# Altium schematic sheet Solution_2.SchDoc
size A4
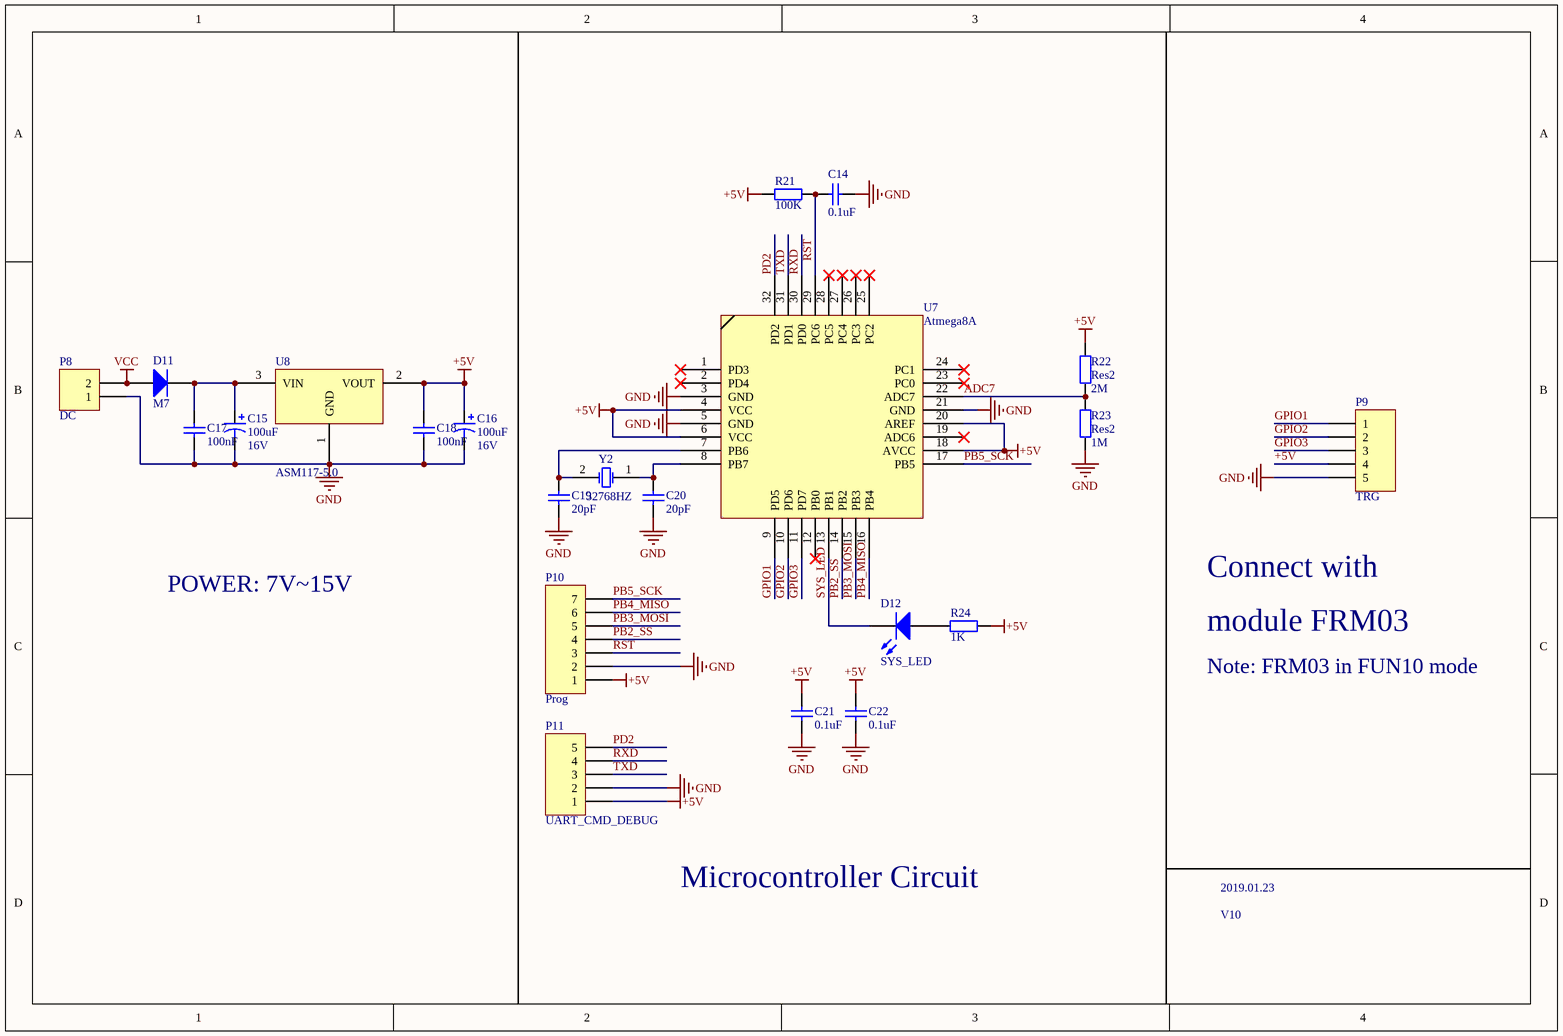
[diagram p0: Solution_2.SchDoc]

## Parts
C14  0.1uF  [RAD-0.3]
C15  100uF  value 16V  [C0805]
C16  100uF  value 16V  [C0805]
C17  100nF  [RAD-0.3]
C18  100nF  [RAD-0.3]
C19  20pF  [RAD-0.3]
C20  20pF  [RAD-0.3]
C21  0.1uF  [RAD-0.3]
C22  0.1uF  [RAD-0.3]
D11  M7  [SMC]
D12  SYS_LED  [LED-0]
P8  DC  [HDR1X2]
P9  TRG  [HDR1X5]
P10  Prog  [HDR1X7]
P11  UART_CMD_DEBUG  [HDR1X5]
R21  100K  [AXIAL-0.4]
R22  Res2  value 2M  [AXIAL-0.4]
R23  Res2  value 1M  [AXIAL-0.4]
R24  1K  [AXIAL-0.4]
U7  Atmega8A
U8  ASM117-5.0
Y2  32768HZ  [R38]

## Nets
+5V: C16.1 C18.2 C21.2 C22.2 P9.4 P10.1 P11.1 R21.1 R22.2 R24.2 U7.4(VCC) U7.6(VCC) U7.18(AVCC) U7.20(AREF) U8.2(VOUT)
GND: C14.1 C15.2 C16.2 C17.1 C18.1 C19.1 C20.1 C21.1 C22.1 P8.1 P9.5 P10.2 P11.2 R23.1 U7.3(GND) U7.5(GND) U7.21(GND) U8.1(GND)
VCC: D11.1(A) P8.2
ADC7: R22.1 R23.2 U7.22(ADC7)
GPIO1: P9.1 U7.9(PD5)
GPIO2: P9.2 U7.10(PD6)
GPIO3: P9.3 U7.11(PD7)
PB2_SS: P10.4 U7.14(PB2)
PB3_MOSI: P10.5 U7.15(PB3)
PB4_MISO: P10.6 U7.16(PB4)
PB5_SCK: P10.7 U7.17(PB5)
PD2: P11.5 U7.32(PD2)
RST: C14.2 P10.3 R21.2 U7.29(PC6)
RXD: P11.4 U7.30(PD0)
SYS_LED: D12.2(K) U7.13(PB1)
TXD: P11.3 U7.31(PD1)
NetC15_1: C15.1 C17.2 D11.2(K) U8.3(VIN)
NetC19_2: C19.2 U7.7(PB6) Y2.2(OSC2)
NetC20_2: C20.2 U7.8(PB7) Y2.1(OSC1)
NetD12_1: D12.1(A) R24.1

Not connected (* = marked no-connect by the designer): U7 1(PD3)* 2(PD4)* 12(PB0)* 19(ADC6)* 23(PC0)* 24(PC1)* 25(PC2)* 26(PC3)* 27(PC4)* 28(PC5)*

## Notes on the sheet
- Connect with
- POWER: 7V~15V
- module FRM03
- Note: FRM03 in FUN10 mode
- Microcontroller Circuit
- V10
- 2019.01.23

## Library data of the parts
C14 C19-C22 = Cap: Capacitor; Value: 100pF; Published: 8-Jun-2000; LatestRevisionDate: 17-Jul-2002; LatestRevisionNote: Re-released for DXP Platform.; PackageReference: RAD-0.3; Publisher: Altium Limited; PackageDescription: Radial Cap, Thru-Hole; 2 Leads; 0.3 in Pin Spacing
C15 C16 = Cap Pol3: Polarized Capacitor (Surface Mount); Published: 8-Jun-2000; LatestRevisionDate: 29-May-2009; LatestRevisionNote: IPC-7351 Footprint Added.; PackageReference: C0805; Publisher: Altium Limited; PackageDescription: Chip Capacitor
C17 C18 = Cap: Capacitor; Published: 8-Jun-2000; LatestRevisionDate: 17-Jul-2002; LatestRevisionNote: Re-released for DXP Platform.; PackageReference: RAD-0.3; Publisher: Altium Limited; PackageDescription: Radial Cap, Thru-Hole; 2 Leads; 0.3 in Pin Spacing; Value: 100nF
D11 = Diode: Default Diode; Published: 8-Jun-2000; LatestRevisionDate: 17-Jul-2002; LatestRevisionNote: Re-released for DXP Platform.; PackageVersion: Sep-1996; PackageReference: SMC; Publisher: Altium Limited; PackageDescription: DO-214-AB/SMC; 2 C-Bend Leads; Body 7.9 x 5.9 mm, inc. leads (LxW); Code_JEDEC: DO-214-AB
D12 = LED0: Typical INFRARED GaAs LED; Published: 8-Jun-2000; LatestRevisionDate: 08-Jul-2005; LatestRevisionNote: Mech Layer 1 removed.; PackageReference: LED-0; Publisher: Altium Limited; PackageDescription: LED; 2 Leads
P8 = Header 2: Header, 2-Pin; LatestRevisionDate: 17-Jul-2002; LatestRevisionNote: Re-released for DXP Platform.; Publisher: Altium Limited
P9 P11 = Header 5: Header, 5-Pin; LatestRevisionDate: 17-Jul-2002; LatestRevisionNote: Re-released for DXP Platform.; Publisher: Altium Limited
P10 = Header 7: Header, 7-Pin; LatestRevisionDate: 17-Jul-2002; LatestRevisionNote: Re-released for DXP Platform.; Publisher: Altium Limited
R21 = Res2: Resistor; Value: 1K; Published: 8-Jun-2000; LatestRevisionDate: 17-Jul-2002; LatestRevisionNote: Re-released for DXP Platform.; PackageReference: AXIAL-0.4; Publisher: Altium Limited; PackageDescription: Axial Device, Thru-Hole; 2 Leads; 0.4 in Pin Spacing
R22-R24 = Res2: Resistor; Published: 8-Jun-2000; LatestRevisionDate: 17-Jul-2002; LatestRevisionNote: Re-released for DXP Platform.; PackageReference: AXIAL-0.4; Publisher: Altium Limited; PackageDescription: Axial Device, Thru-Hole; 2 Leads; 0.4 in Pin Spacing
  R24: Value: 1K
U7 = ATMEGA8A: AVR 8bit microcontroller
U8 = ASM117-5.0: 5V 1A LOW DROPOUT VOLTAGE REGULATOR
Y2 = XTAL: Crystal Oscillator; Published: 8-Jun-2000; LatestRevisionDate: 17-Jul-2002; LatestRevisionNote: Re-released for DXP Platform.; PackageReference: R38; Publisher: Altium Limited; PackageDescription: Crystal, Thru-Hole; 2 Leads; Body 3.1 x 8.2 mm (Dia.xH)